# Altium schematic sheet Boost.SchDoc
size A4; SheetNumber: 4; SheetTotal: 6
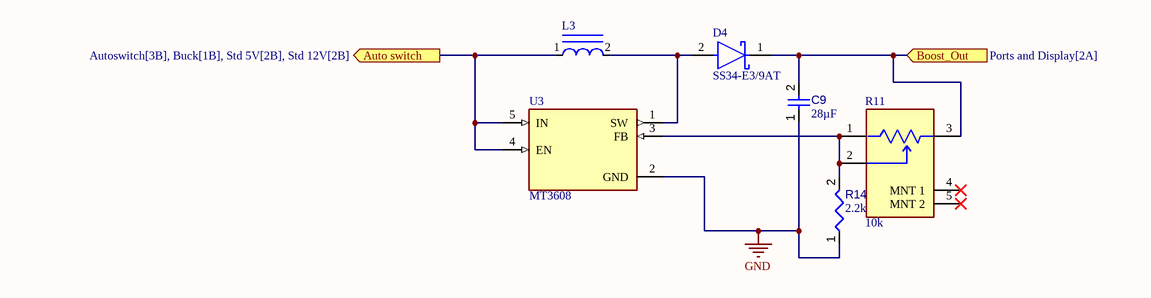
[diagram p0: Boost.SchDoc]

## Parts
C9  value 28µF  [CAPC0805(2012)145_L]  (hidden comment: Capacitor 47µF +/-40% 6.3V 0805)
D4  SS34-E3/9AT  [FP-SMC-MFG]
L3  DR127-330-R  [FP-DR127-MFG]  (value not drawn)
R11  value 10k  [FP-PTV09A-4-MFG]  (hidden comment: PTV09A-4225F-B103)
R14  value 2.2k  [RESC0805(2012)_L]  (hidden comment: 1KR5J)
U3  MT3608  [SOT95P280X145-6N]

## Ports
Auto switch (out, see Autoswitch[3B], Buck[1B], Std 5V[2B], Std 12V[2B]), Boost_Out (in, see Ports and Display[2A])

## Nets
GND: C9.1 R14.1 U3.2(GND)
Auto switch: L3.1 U3.4(EN) U3.5(IN) ; port Auto switch
Boost_Out: C9.2 D4.1(C) R11.3 ; port Boost_Out
NetD4_2: D4.2(A) L3.2 U3.1(SW)
NetR11_1: R11.1 R11.2 R14.2 U3.3(FB)

Not connected (* = marked no-connect by the designer): R11 4(MNT_1)* 5(MNT_2)*

## Library data of the parts
C9 = CMP-001-00082-4: Chip Capacitor, 47µF +/-40%, 6.3V, 0805, Thickness 1.45 mm; Tolerance: 10%; Min Operating Temperature: -55°C; Max Operating Temperature: 85°C; Case/Package: 0805; Pins: 2; Mounting Technology: SMT; Voltage Rating: 6.3V
D4 = CMP-004-00032-1: Rectifier Diode, Schottky, 1 Phase, 1 Element, 3A, 40V V(RRM), Silicon, DO-214AB; Max Reverse Current: 500uA; Time @ Peak Reflow Temperature-Max (s): 40s; Case Connection: CATHODE; Qualification Status: Not Qualified; Non-rep Pk Forward Current-Max: 100A; Number of Phases: 1; Package Body Material: Plastic; Application(s): EFFICIENCY; Forward Voltage: 500mV; Diode Type: RECTIFIER; Max Output current: 3A; Peak Reflow Temperature (Cel): 260°C; Package Shape: Rectangular; Terminal Position: DUAL; Terminal Finish: Tin; Min Operating Temperature: -55°C; Max Operating Temperature: 150°C; Diode Element Material: SILICON; Package Style: SMALL OUTLINEMeter; Technology: SCHOTTKY; Number of Elements: 1; Moisture Sensitivity Level: 1; Surface Mount: Yes; JESD-30 Code: R-PDSO-C2; RoHS Compliant: Yes; Rep Pk Reverse Voltage-Max: 40V; Terminal Form: C BEND; Pins: 2; JESD-609 Code: e3; JEDEC-95 Code: DO-214AB; Reach SVHC Compliant: No
L3 = CMP-006-00021-1: General Purpose Inductor, 33uH, 20%, 1 Element, Ferrite-Core, SMD, 4949; Package Width: 12.5mm; Case/Size Code: 4949; Shape/Size Description: RECTANGULAR PACKAGE; Inductor Application: DC-DC CONVERTER; Channels: 1; Test Frequency: 100kHz; Package Height: 8mm; Shielding: Shielded; Max Current Rating: 3.23A; DC Resistance (DCR): 60mR; Reach SVHC Compliant: Yes; Surface Mount: Yes; Max Operating Temperature: 125°C; Terminal Placement: Dual Ended; JESD-609 Code: e3; Package Style: SMTMeter; Inductance-Nom (L): 33uH; Package Length: 12.5mm; Tolerance: 20%; RoHS Compliant: Yes; Termination: One Surface; Inductor Type: GENERAL PURPOSE INDUCTOR; Pins: 2; Core Material: Ferrite; Terminal Finish: Nickel; Min Operating Temperature: -40°C; Packaging: Tape and Reel; Construction: Magnetic Shielded
R11 = CMP-009-00177-1: Potentiometer, Carbon, 0.05W, 10000ohm, 20V, 20% +/-Tol, 3943; Package Length: 9.8mm; Rotational Angle: 280°; Package Width: 11mm; Package Height: 6.8mm; Power: 50mW; Min Operating Temperature: -10°C; JESD-609 Code: e3; Max Operating Temperature: 50°C; Tolerance: 20%; Terminal Finish: Copper; Construction: SQUARE; Case/Package: 3943; Reach SVHC Compliant: Yes; Working Voltage: 20V; RoHS Compliant: Yes; Technology: CARBON; Resistor Type: Potentiometer
R14 = CMP-009-00076-2: 1K 0.125W 5% 0805 (2012 Metric)  SMD; Power: 125mW; Pins: 2; Mounting Technology: SMT; Tolerance: 5%; Case/Package: 0805
U3 = CMP-019-000000-1: High Efficiency 1.2MHz2A Step Up Converter; MF: Aerosemi Technology Co., Ltd; Availability: Not in stock; Design Item ID: MT3608; SnapEDA_Link: https://www.snapeda.com/parts/MT3608/Aerosemi+Technology+Co.%252C+Ltd/view-part/?ref=snap; Source: MT3608.SchLib; Pin Count: 5; Value: *; MP: MT3608; Package: Package; Check_prices: https://www.snapeda.com/parts/MT3608/Aerosemi+Technology+Co.%252C+Ltd/view-part/?ref=eda; Price: None; Component Type: Standard